# EAGLE schematic OmnibusB (EAGLE 6.6.0), part 1 of 2

## Sheet 1 of 4
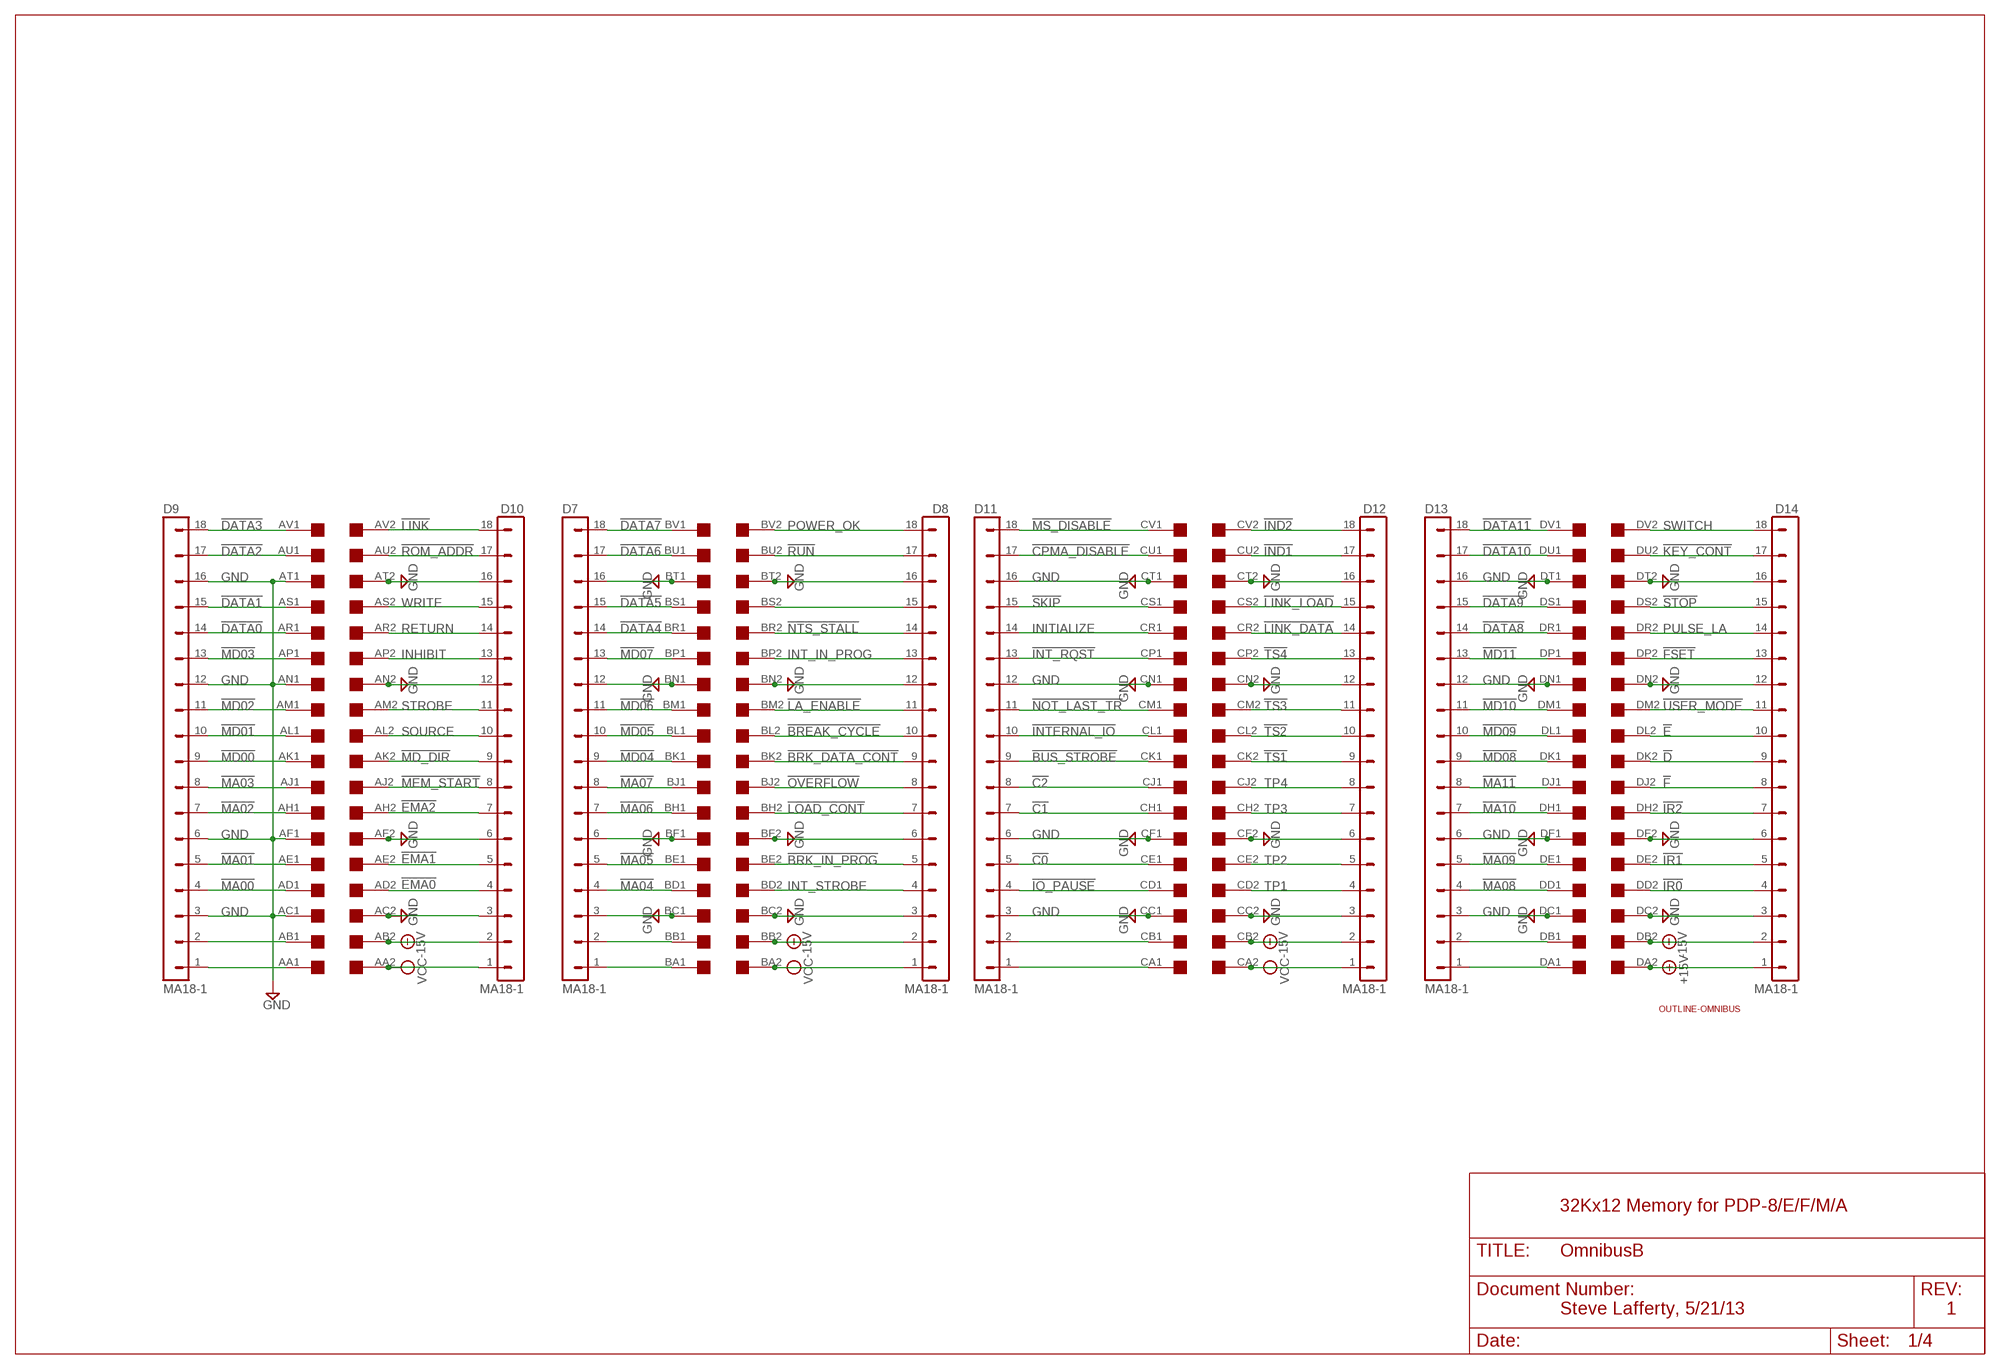
[diagram p0: schematic, sheet 1]

### Parts
D7  MA18-1  [MA18-1]
D8  MA18-1  [MA18-1]
D9  MA18-1  [MA18-1]
D10  MA18-1  [MA18-1]
D11  MA18-1  [MA18-1]
D12  MA18-1  [MA18-1]
D13  MA18-1  [MA18-1]
D14  MA18-1  [MA18-1]
U$1  OUTLINE-OMNIBUS  [OMNIBUS]
U$2  QUAD  [EDGE-CON8]

### Nets
!BREAK_CYCLE: D8.10 U$2.BL2
!BRK_DATA_CONT: D8.9 U$2.BK2
!BRK_IN_PROG: D8.5 U$2.BE2
!BUS_STROBE: D11.9 U$2.CK1
!C0: D11.5 U$2.CE1
!C1: D11.7 U$2.CH1
!C2: D11.8 U$2.CJ1
!CPMA_DISABLE: D11.17 U$2.CU1
!D: D14.9 U$2.DK2
!DATA0: D9.14 U$2.AR1
!DATA1: D9.15 U$2.AS1
!DATA2: D9.17 U$2.AU1
!DATA3: D9.18 U$2.AV1
!DATA4: D7.14 U$2.BR1
!DATA5: D7.15 U$2.BS1
!DATA6: D7.17 U$2.BU1
!DATA7: D7.18 U$2.BV1
!DATA8: D13.14 U$2.DR1
!DATA9: D13.15 U$2.DS1
!DATA10: D13.17 U$2.DU1
!DATA11: D13.18 U$2.DV1
!E: D14.10 U$2.DL2
!EMA0: D10.4 U$2.AD2 ; also sheet 2
!EMA1: D10.5 U$2.AE2 ; also sheet 2
!EMA2: D10.7 U$2.AH2 ; also sheet 2
!F: D14.8 U$2.DJ2
!FSET: D14.13 U$2.DP2
!IND1: D12.17 U$2.CU2
!IND2: D12.18 U$2.CV2
!INT_RQST: D11.13 U$2.CP1
!INTERNAL_IO: D11.10 U$2.CL1
!IO_PAUSE: D11.4 U$2.CD1
!IR0: D14.4 U$2.DD2
!IR1: D14.5 U$2.DE2
!IR2: D14.7 U$2.DH2
!KEY_CONT: D14.17 U$2.DU2
!LA_ENABLE: D8.11 U$2.BM2
!LINK: D10.18 U$2.AV2
!LINK_DATA: D12.14 U$2.CR2
!LINK_LOAD: D12.15 U$2.CS2
!LOAD_CONT: D8.7 U$2.BH2
!MA00: D9.4 U$2.AD1 ; also sheet 2
!MA01: D9.5 U$2.AE1 ; also sheet 2
!MA02: D9.7 U$2.AH1 ; also sheet 2
!MA03: D9.8 U$2.AJ1 ; also sheet 2
!MA04: D7.4 U$2.BD1 ; also sheet 2
!MA05: D7.5 U$2.BE1 ; also sheet 2
!MA06: D7.7 U$2.BH1 ; also sheet 2
!MA07: D7.8 U$2.BJ1 ; also sheet 2
!MA08: D13.4 U$2.DD1 ; also sheet 2
!MA09: D13.5 U$2.DE1 ; also sheet 2
!MA10: D13.7 U$2.DH1 ; also sheet 2
!MA11: D13.8 U$2.DJ1 ; also sheet 2
!MD00: D9.9 U$2.AK1 ; also sheet 2
!MD01: D9.10 U$2.AL1 ; also sheet 2
!MD02: D9.11 U$2.AM1 ; also sheet 2
!MD03: D9.13 U$2.AP1 ; also sheet 2
!MD04: D7.9 U$2.BK1 ; also sheet 2
!MD05: D7.10 U$2.BL1 ; also sheet 2
!MD06: D7.11 U$2.BM1 ; also sheet 2
!MD07: D7.13 U$2.BP1 ; also sheet 2
!MD08: D13.9 U$2.DK1 ; also sheet 2
!MD09: D13.10 U$2.DL1 ; also sheet 2
!MD10: D13.11 U$2.DM1 ; also sheet 2
!MD11: D13.13 U$2.DP1 ; also sheet 2
!MD_DIR: D10.9 U$2.AK2 ; also sheet 2
!MEM_START: D10.8 U$2.AJ2
!MS_DISABLE: D11.18 U$2.CV1
!NOT_LAST_TR: D11.11 U$2.CM1
!NTS_STALL: D8.14 U$2.BR2
!OVERFLOW: D8.8 U$2.BJ2
!ROM_ADDR: D10.17 U$2.AU2 ; also sheet 2
!RUN: D8.17 U$2.BU2
!SKIP: D11.15 U$2.CS1
!STOP: D14.15 U$2.DS2
!TS1: D12.9 U$2.CK2
!TS2: D12.10 U$2.CL2
!TS3: D12.11 U$2.CM2
!TS4: D12.13 U$2.CP2
!USER_MODE: D14.11 U$2.DM2
+15V: D14.1 U$2.DA2
-15V [supply]: D8.2 D10.2 D12.2 D14.2 U$2.AB2 U$2.BB2 U$2.CB2 U$2.DB2
GND [supply]: D7.3 D7.6 D7.12 D7.16 D8.3 D8.6 D8.12 D8.16 D9.3 D9.6 D9.12 D9.16 D10.3 D10.6 D10.12 D10.16 D11.3 D11.6 D11.12 D11.16 D12.3 D12.6 D12.12 D12.16 D13.3 D13.6 D13.12 D13.16 D14.3 D14.6 D14.12 D14.16 U$2.AC1 U$2.AC2 U$2.AF1 U$2.AF2 U$2.AN1 U$2.AN2 U$2.AT1 U$2.AT2 U$2.BC1 U$2.BC2 U$2.BF1 U$2.BF2 U$2.BN1 U$2.BN2 U$2.BT1 U$2.BT2 U$2.CC1 U$2.CC2 U$2.CF1 U$2.CF2 U$2.CN1 U$2.CN2 U$2.CT1 U$2.CT2 U$2.DC1 U$2.DC2 U$2.DF1 U$2.DF2 U$2.DN1 U$2.DN2 U$2.DT1 U$2.DT2 ; also sheet 2,3,4
INHIBIT: D10.13 U$2.AP2
INITIALIZE: D11.14 U$2.CR1
INT_IN_PROG: D8.13 U$2.BP2
INT_STROBE: D8.4 U$2.BD2
N$46: D9.2 U$2.AB1
N$47: D9.1 U$2.AA1
N$48: D7.2 U$2.BB1
N$49: D7.1 U$2.BA1
N$50: D11.1 U$2.CA1
N$51: D8.15 U$2.BS2
N$52: D11.2 U$2.CB1
N$53: D13.1 U$2.DA1
N$54: D13.2 U$2.DB1
POWER_OK: D8.18 U$2.BV2 ; also sheet 2
PULSE_LA: D14.14 U$2.DR2
RETURN: D10.14 U$2.AR2
SOURCE: D10.10 U$2.AL2 ; also sheet 2
STROBE: D10.11 U$2.AM2
SWITCH: D14.18 U$2.DV2
TP1: D12.4 U$2.CD2
TP2: D12.5 U$2.CE2
TP3: D12.7 U$2.CH2
TP4: D12.8 U$2.CJ2
VCC [supply]: D8.1 D10.1 D12.1 U$2.AA2 U$2.BA2 U$2.CA2 ; also sheet 2,4
WRITE: D10.15 U$2.AS2 ; also sheet 2

### Notes on the sheet
- 32Kx12 Memory for PDP-8/E/F/M/A
- Steve Lafferty, 5/21/13 | 1

## Sheet 2 of 4
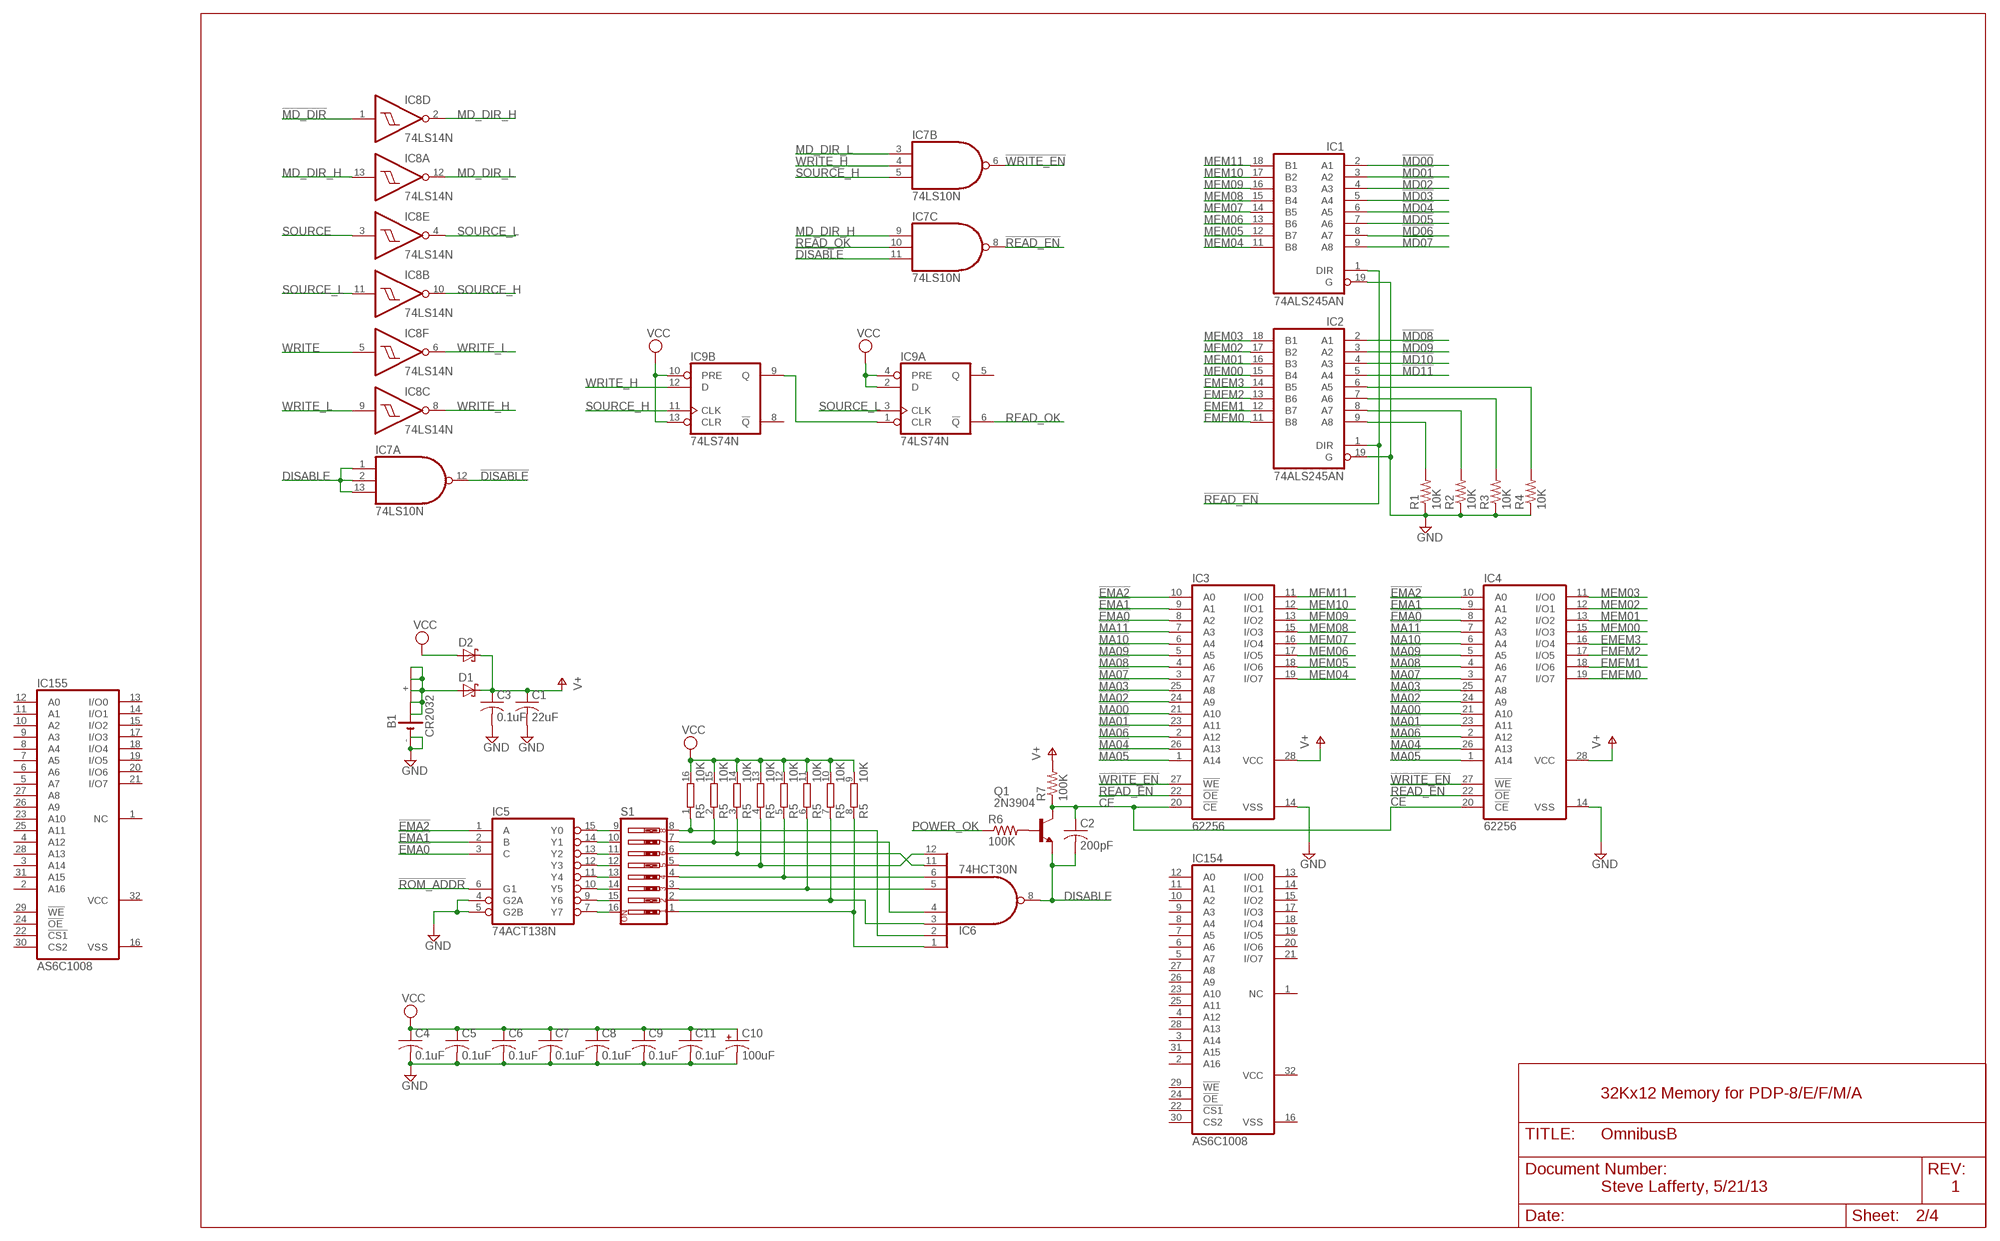
[diagram p1: schematic, sheet 2]

### Parts
B1  CR2032  B2430UNI  [B2430UNI]
C1  22uF  C-US050-025X075  [C050-025X075]
C2  200pF  C-US050-025X075  [C050-025X075]
C3  0.1uF  C-US050-025X075  [C050-025X075]
C4  0.1uF  C-US050-025X075  [C050-025X075]
C5  0.1uF  C-US050-025X075  [C050-025X075]
C6  0.1uF  C-US050-025X075  [C050-025X075]
C7  0.1uF  C-US050-025X075  [C050-025X075]
C8  0.1uF  C-US050-025X075  [C050-025X075]
C9  0.1uF  C-US050-025X075  [C050-025X075]
C10  100uF  CPOL-USE20-8AXIAL  [E12-8]
C11  0.1uF  C-US050-025X075  [C050-025X075]
D1  BAT19  [DO35-10]
D2  BAT19  [DO35-10]
IC1  74ALS245AN  74LS245N  [DIL20]
IC2  74ALS245AN  74LS245N  [DIL20]
IC3  62256  58C256P  [DIL28-6]
IC4  62256  58C256P  [DIL28-6]
IC5  74ACT138N  74LS138N  [DIL16]
IC6  74HCT30N  74LS30N  [DIL14]
IC7  74LS10N  [DIL14]
IC8  74LS14N  [DIL14]
IC9  74LS74N  [DIL14]
IC154  AS6C1008  628128P  [DIL32]
IC155  AS6C1008  628128P  [DIL32]
Q1  2N3904  [TO92]
R1  10K  R-US_0207/10  [0207/10]
R2  10K  R-US_0207/10  [0207/10]
R3  10K  R-US_0207/10  [0207/10]
R4  10K  R-US_0207/10  [0207/10]
R5  10K  8R-P  [DIL16]
R6  100K  R-US_0207/10  [0207/10]
R7  100K  R-US_0207/10  [0207/10]
S1  SW_DIP-8  [EDG-08]

### Nets
!CE: C2.1 IC3.20(!CE) IC4.20(!CE) Q1.1(C) R7.1
!DISABLE: IC7.11(C:I2) IC7.12(A:O)
!EMA0: IC3.8(A2) IC4.8(A2) IC5.3(C) ; also sheet 1
!EMA1: IC3.9(A1) IC4.9(A1) IC5.2(B) ; also sheet 1
!EMA2: IC3.10(A0) IC4.10(A0) IC5.1(A) ; also sheet 1
!MA00: IC3.21(A10) IC4.21(A10) ; also sheet 1
!MA01: IC3.23(A11) IC4.23(A11) ; also sheet 1
!MA02: IC3.24(A9) IC4.24(A9) ; also sheet 1
!MA03: IC3.25(A8) IC4.25(A8) ; also sheet 1
!MA04: IC3.26(A13) IC4.26(A13) ; also sheet 1
!MA05: IC3.1(A14) IC4.1(A14) ; also sheet 1
!MA06: IC3.2(A12) IC4.2(A12) ; also sheet 1
!MA07: IC3.3(A7) IC4.3(A7) ; also sheet 1
!MA08: IC3.4(A6) IC4.4(A6) ; also sheet 1
!MA09: IC3.5(A5) IC4.5(A5) ; also sheet 1
!MA10: IC3.6(A4) IC4.6(A4) ; also sheet 1
!MA11: IC3.7(A3) IC4.7(A3) ; also sheet 1
!MD00: IC1.2(A1) ; also sheet 1
!MD01: IC1.3(A2) ; also sheet 1
!MD02: IC1.4(A3) ; also sheet 1
!MD03: IC1.5(A4) ; also sheet 1
!MD04: IC1.6(A5) ; also sheet 1
!MD05: IC1.7(A6) ; also sheet 1
!MD06: IC1.8(A7) ; also sheet 1
!MD07: IC1.9(A8) ; also sheet 1
!MD08: IC2.2(A1) ; also sheet 1
!MD09: IC2.3(A2) ; also sheet 1
!MD10: IC2.4(A3) ; also sheet 1
!MD11: IC2.5(A4) ; also sheet 1
!MD_DIR: IC8.1(D:I) ; also sheet 1
!READ_EN: IC1.1(DIR) IC2.1(DIR) IC3.22(!OE) IC4.22(!OE) IC7.8(C:O)
!ROM_ADDR: IC5.6(G1) ; also sheet 1
!WRITE_EN: IC3.27(!WE) IC4.27(!WE) IC7.6(B:O)
DISABLE: C2.2 IC6.8(O) IC7.1(A:I0) IC7.2(A:I1) IC7.13(A:I2) Q1.3(E)
EMEM0: IC2.11(B8) IC4.19(I/O7)
EMEM1: IC2.12(B7) IC4.18(I/O6)
EMEM2: IC2.13(B6) IC4.17(I/O5)
EMEM3: IC2.14(B5) IC4.16(I/O4)
GND [supply]: B1.- B1.-@1(-) C1.2 C3.2 C4.2 C5.2 C6.2 C7.2 C8.2 C9.2 C10.- C11.2 IC1.19(G) IC2.19(G) IC3.14(VSS) IC4.14(VSS) IC5.4(G2A) IC5.5(G2B) R1.1 R2.1 R3.1 R4.1 ; also sheet 1,3,4
MD_DIR_H: IC7.9(C:I0) IC8.2(D:O) IC8.13(A:I)
MD_DIR_L: IC7.3(B:I0) IC8.12(A:O)
MEM00: IC2.15(B4) IC4.15(I/O3)
MEM01: IC2.16(B3) IC4.13(I/O2)
MEM02: IC2.17(B2) IC4.12(I/O1)
MEM03: IC2.18(B1) IC4.11(I/O0)
MEM04: IC1.11(B8) IC3.19(I/O7)
MEM05: IC1.12(B7) IC3.18(I/O6)
MEM06: IC1.13(B6) IC3.17(I/O5)
MEM07: IC1.14(B5) IC3.16(I/O4)
MEM08: IC1.15(B4) IC3.15(I/O3)
MEM09: IC1.16(B3) IC3.13(I/O2)
MEM10: IC1.17(B2) IC3.12(I/O1)
MEM11: IC1.18(B1) IC3.11(I/O0)
N$1: IC5.7(Y7) S1.16
N$18: IC5.9(Y6) S1.15
N$19: IC5.10(Y5) S1.14
N$20: IC5.11(Y4) S1.13
N$21: IC5.12(Y3) S1.12
N$22: IC5.13(Y2) S1.11
N$23: IC5.14(Y1) S1.10
N$24: IC5.15(Y0) S1.9
N$25: B1.+ B1.+@1(+) B1.+@2(+) B1.+@3(+) B1.+@4(+) D1.A
N$26: IC6.12(I7) R5.4 S1.5
N$27: IC6.11(I6) R5.3 S1.6
N$28: IC6.6(I5) R5.5 S1.4
N$29: IC6.5(I4) R5.6 S1.3
N$30: IC6.3(I2) R5.7 S1.2
N$31: IC6.1(I0) R5.8 S1.1
N$32: IC6.2(I1) R5.1 S1.8
N$33: IC6.4(I3) R5.2 S1.7
N$35: IC2.6(A5) R4.2
N$36: Q1.2(B) R6.2
N$37: IC2.7(A6) R3.2
N$38: IC2.8(A7) R2.2
N$39: IC2.9(A8) R1.2
N$834: IC9.1(A:CLR) IC9.9(B:Q)
POWER_OK: R6.1 ; also sheet 1
READ_OK: IC7.10(C:I1) IC9.6(A:!Q)
SOURCE: IC8.3(E:I) ; also sheet 1
SOURCE_H: IC7.5(B:I2) IC8.10(B:O) IC9.11(B:CLK)
SOURCE_L: IC8.4(E:O) IC8.11(B:I) IC9.3(A:CLK)
V+: C1.1 C3.1 D1.C D2.C IC3.28(VCC) IC4.28(VCC) R7.2
VCC [supply]: C4.1 C5.1 C6.1 C7.1 C8.1 C9.1 C10.+ C11.1 D2.A IC9.2(A:D) IC9.4(A:PRE) IC9.10(B:PRE) IC9.13(B:CLR) R5.9 R5.10 R5.11 R5.12 R5.13 R5.14 R5.15 R5.16 ; also sheet 1,4
WRITE: IC8.5(F:I) ; also sheet 1
WRITE_H: IC7.4(B:I1) IC8.8(C:O) IC9.12(B:D)
WRITE_L: IC8.6(F:O) IC8.9(C:I)
Unconnected: IC9.5(A:Q) IC9.8(B:!Q) IC154.1(NC) IC154.2(A16) IC154.3(A14) IC154.4(A12) IC154.5(A7) IC154.6(A6) IC154.7(A5) IC154.8(A4) IC154.9(A3) IC154.10(A2) IC154.11(A1) IC154.12(A0) IC154.13(I/O0) IC154.14(I/O1) IC154.15(I/O2) IC154.17(I/O3) IC154.18(I/O4) IC154.19(I/O5) IC154.20(I/O6) IC154.21(I/O7) IC154.22(!CS1) IC154.23(A10) IC154.24(!OE) IC154.25(A11) IC154.26(A9) IC154.27(A8) IC154.28(A13) IC154.29(!WE) IC154.30(CS2) IC154.31(A15) IC155.1(NC) IC155.2(A16) IC155.3(A14) IC155.4(A12) IC155.5(A7) IC155.6(A6) IC155.7(A5) IC155.8(A4) IC155.9(A3) IC155.10(A2) IC155.11(A1) IC155.12(A0) IC155.13(I/O0) IC155.14(I/O1) IC155.15(I/O2) IC155.17(I/O3) IC155.18(I/O4) IC155.19(I/O5) IC155.20(I/O6) IC155.21(I/O7) IC155.22(!CS1) IC155.23(A10) IC155.24(!OE) IC155.25(A11) IC155.26(A9) IC155.27(A8) IC155.28(A13) IC155.29(!WE) IC155.30(CS2) IC155.31(A15)

### Notes on the sheet
- 32Kx12 Memory for PDP-8/E/F/M/A
- Steve Lafferty, 5/21/13 | 1

## Sheet 3 of 4
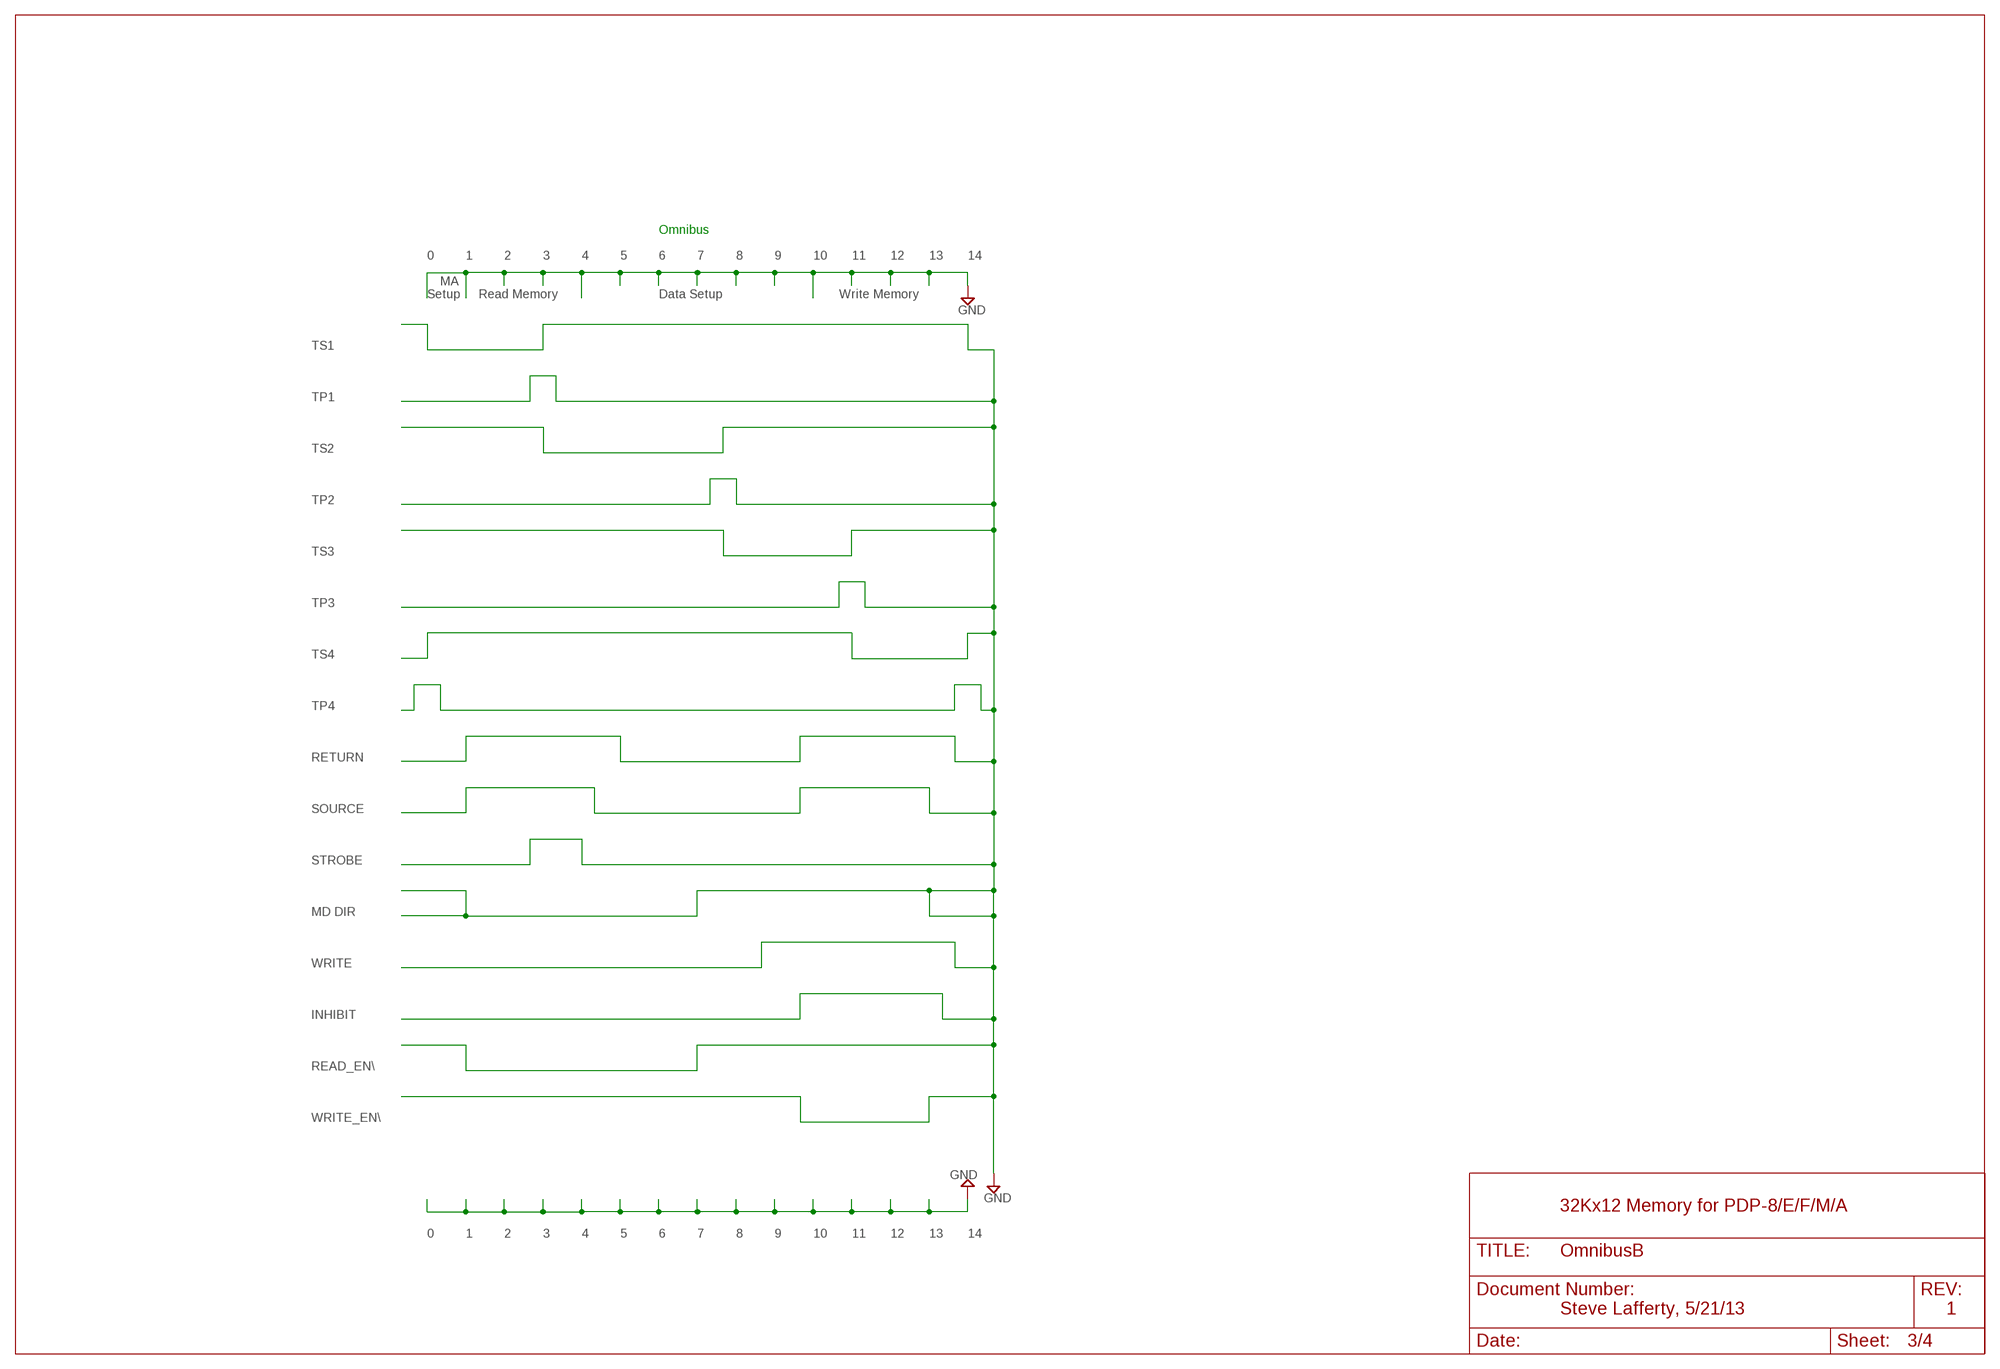
[diagram p2: schematic, sheet 3]

### Notes on the sheet
- Omnibus
- 0 | 1 | 2 | 3 | 4 | 5 | 6 | 7 | 8 | 9 | 10 | 11 | 12 | 13 | 14
- MA
- Setup | Read Memory | Data Setup | Write Memory
- TS1
- TP1
- TS2
- TP2
- TS3
- TP3
- TS4
- TP4
- RETURN
- SOURCE
- STROBE
- MD DIR
- WRITE
- INHIBIT
- READ_EN\\
- WRITE_EN\\
- 32Kx12 Memory for PDP-8/E/F/M/A
- 0 | 1 | 2 | 3 | 4 | 5 | 6 | 7 | 8 | 9 | 10 | 11 | 12 | 13 | 14
- Steve Lafferty, 5/21/13 | 1